# EAGLE design pov (EAGLE 6.1)
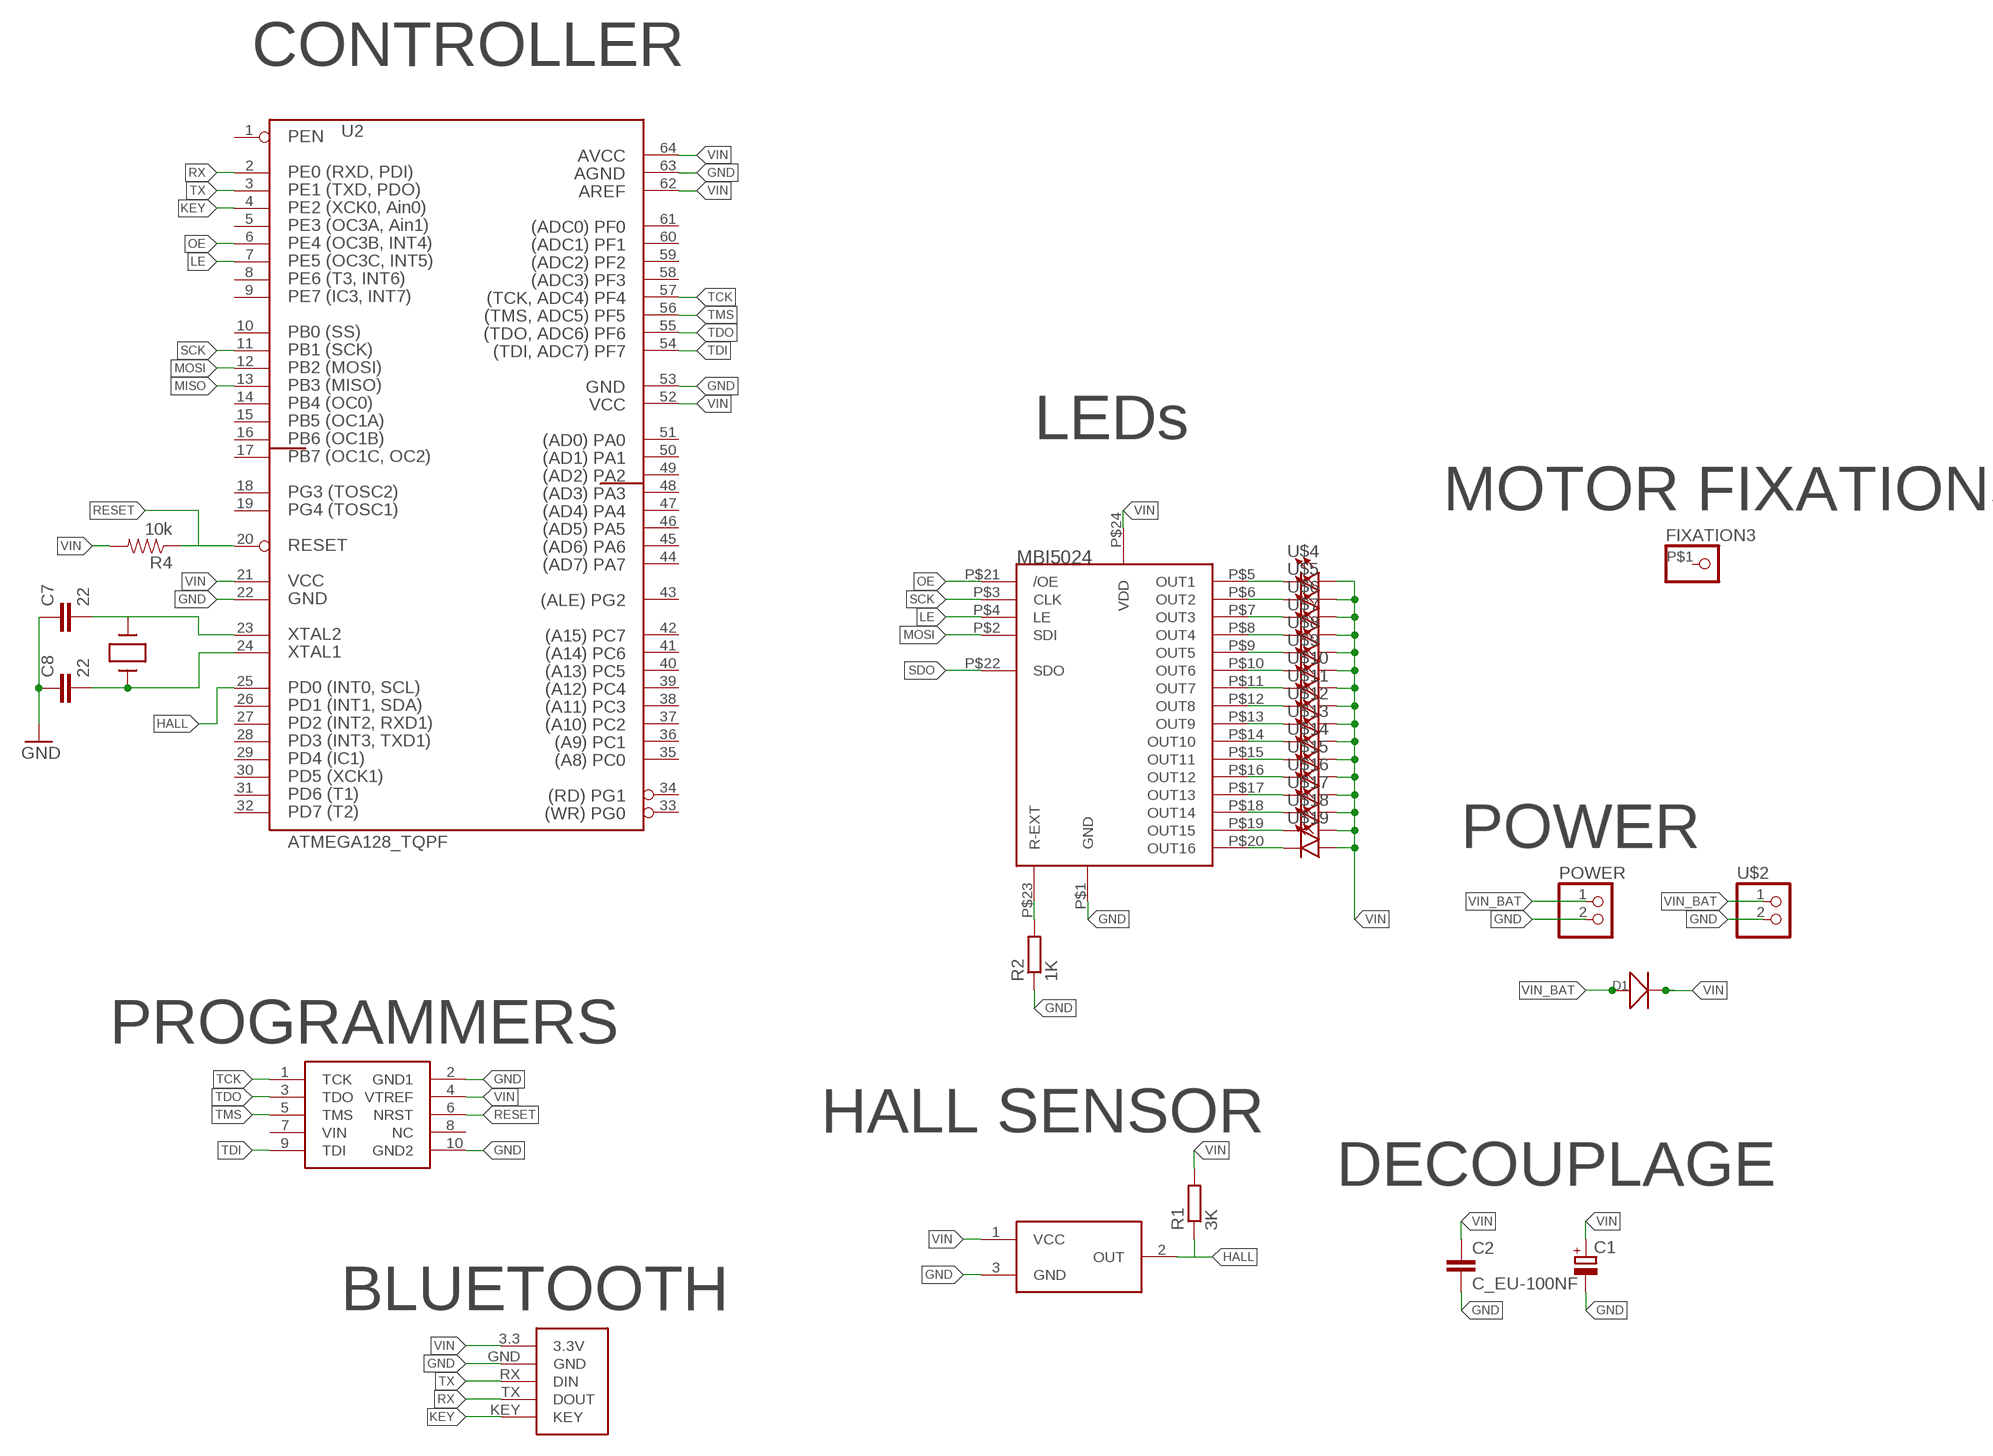
[diagram p0: schematic, sheet 1]

## Parts
C1  CPOL_EU-680UF_25V  [E3,5-8]
C2  C_EU-100NF  [C0805]
C7  22  C_EU_22PF  [C0603]
C8  22  C_EU_22PF  [C0603]
D1  D-SOD-123  [SOD123]
FIXATION3  CONNEC_1X01SHAFT  [SHAFT2]
JTAG  AVR_JTAG  [AVR_JTAG]
POWER  CONNEC_1X02BASIC  [CONNEC_1X02]
R1  3K  RESISTANCE-R0805  [R0805]
R2  1K  RESISTANCE-R0805  [R0805]
R4  10k  RESISTOR0805-RES  [0805]
U1  MBI5024  [SOP24L-300-1.0]
U2  ATMEGA128_TQPF  [TQFP64]
U$1  DRV5023FAEDBZRQ1  [SOT-23]
U$2  CONNEC_1X02  [JST_GH_2P]
U$4  LED1206  [LED-1206]
U$5  LED1206  [LED-1206]
U$6  LED1206  [LED-1206]
U$7  LED1206  [LED-1206]
U$8  LED1206  [LED-1206]
U$9  LED1206  [LED-1206]
U$10  LED1206  [LED-1206]
U$11  LED1206  [LED-1206]
U$12  LED1206  [LED-1206]
U$13  LED1206  [LED-1206]
U$14  LED1206  [LED-1206]
U$15  LED1206  [LED-1206]
U$16  LED1206  [LED-1206]
U$17  LED1206  [LED-1206]
U$18  LED1206  [LED-1206]
U$19  LED1206  [LED-1206]
U$23  HC05  [HC-05]
XTAL1  QUARTZ  [HC49US]

## Nets
GND: C1.- C2.2 C7.1 C8.1 JTAG.2(GND1) JTAG.10(GND2) POWER.2 R2.1 U1.P$1(GND) U2.22 U2.53 U2.63 U$1.3(GND) U$2.2 U$23.GND
HALL: R1.1 U2.25 U$1.2(OUT)
KEY: U2.4 U$23.KEY
LE: U1.P$4(LE) U2.7
MISO: U2.13
MOSI: U1.P$2(SDI) U2.12
N$1: U1.P$5(OUT1) U$4.C
N$2: U1.P$6(OUT2) U$5.C
N$3: U1.P$7(OUT3) U$6.C
N$4: U1.P$8(OUT4) U$7.C
N$5: U1.P$9(OUT5) U$8.C
N$6: U1.P$10(OUT6) U$9.C
N$7: U1.P$11(OUT7) U$10.C
N$8: U1.P$12(OUT8) U$11.C
N$9: U1.P$13(OUT9) U$12.C
N$10: U1.P$14(OUT10) U$13.C
N$11: U1.P$15(OUT11) U$14.C
N$12: U1.P$16(OUT12) U$15.C
N$13: U1.P$17(OUT13) U$16.C
N$14: U1.P$18(OUT14) U$17.C
N$15: U1.P$19(OUT15) U$18.C
N$16: U1.P$20(OUT16) U$19.C
N$18: R2.2 U1.P$23(R-EXT)
N$19: C7.2 U2.23 XTAL1.2
N$20: C8.2 U2.24 XTAL1.1
OE: U1.P$21(/OE) U2.6
RESET: JTAG.6(NRST) R4.1 U2.20
RX: U2.2 U$23.TX(DOUT)
SCK: U1.P$3(CLK) U2.11
SDO: U1.P$22(SDO)
TCK: JTAG.1(TCK) U2.57
TDI: JTAG.9(TDI) U2.54
TDO: JTAG.3(TDO) U2.55
TMS: JTAG.5(TMS) U2.56
TX: U2.3 U$23.RX(DIN)
VIN: C1.+ C2.1 D1.- JTAG.4(VTREF) R1.2 R4.2 U1.P$24(VDD) U2.21 U2.52 U2.62 U2.64 U$1.1(VCC) U$4.A U$5.A U$6.A U$7.A U$8.A U$9.A U$10.A U$11.A U$12.A U$13.A U$14.A U$15.A U$16.A U$17.A U$18.A U$19.A U$23.3.3(3.3V)
VIN_BAT: D1.+ POWER.1 U$2.1
Unconnected: FIXATION3.P$1 JTAG.7(VIN) JTAG.8(NC) U2.1 U2.5 U2.8 U2.9 U2.10 U2.14 U2.15 U2.16 U2.17 U2.18 U2.19 U2.26 U2.27 U2.28 U2.29 U2.30 U2.31 U2.32 U2.33 U2.34 U2.35 U2.36 U2.37 U2.38 U2.39 U2.40 U2.41 U2.42 U2.43 U2.44 U2.45 U2.46 U2.47 U2.48 U2.49 U2.50 U2.51 U2.58 U2.59 U2.60 U2.61

## Notes on the sheet
- CONTROLLER
- LEDs
- MOTOR FIXATIONS
- MBI5024
- POWER
- PROGRAMMERS
- HALL SENSOR
- DECOUPLAGE
- BLUETOOTH

## Library data of the parts
C1 = rhoban:CPOL_EU: 47uF: http://fr.farnell.com/panasonic-electronic-components/eee1ca470sp/condensateur-elec-alu-47uf-16v/dp/9696946 220uF: http://fr.farnell.com/panasonic-electronic-components/eeefk1c221xp/condensateur-elec-alu-220uf-16v/dp/1850103; DATASHEET: panasonic_aec.pdf; FARNELL_LINK: http://fr.farnell.com/panasonic/eeufr1e681l/capacitor-radial-25v-680uf-20/dp/2063069
C2 = rhoban:C_EU: non polarised condo; DATASHEET: condo100nF.pdf; FARNELL_LINK: http://fr.farnell.com/kemet/c0805c104j5ractu/condensateur-100nf-50v-x7r-0805/dp/1414663RL
C7 C8 = rhoban:C_EU: non polarised condo
D1 = OPL Eagle Library:D*: DIODE
FIXATION3 = rhoban:CONNEC_1X01
JTAG = rhoban:AVR_JTAG
POWER U$2 = rhoban:CONNEC_1X02
R1 R2 = rhoban:RESISTANCE: RESISTOR, European symbol
R4 = SparkFun-Passives:RESISTOR: Resistor Basic schematic elements and footprints for 0603, 1206, and PTH resistors.
U1 = rhoban:MBI5024
U2 = atmel_prototype_header:ATMEGA128: MICROCONTROLLER 128 Kbytes FLASH 4 Kbytes SRAM 4 Kbytes EEPROM DUAL USART 8-channel 10 bit ADC
U$1 = rhoban:DRV5023FAEDBZRQ1
U$4-U$19 = SparkFun-LED:LED: LED (Generic) Standard schematic elements and footprints for 5mm, 3mm, 1206, and 0603 sized LEDs. Generic LEDs with no color specified.
U$23 = rhoban:HC05
XTAL1 = rhoban:QUARTZ

## Net classes
1 alime: width 0.889 mm, drill 0.33 mm

## Board
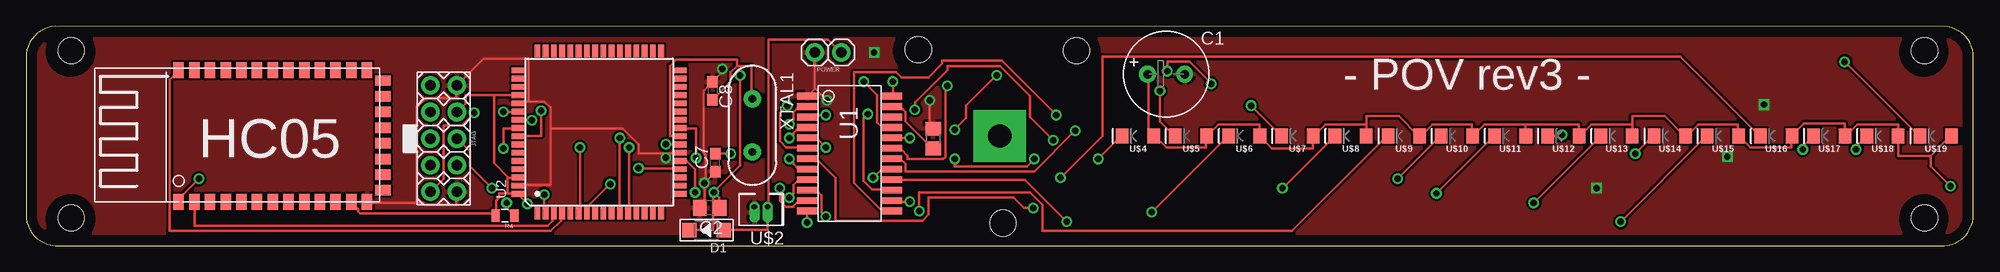
[diagram p1: board, top side]
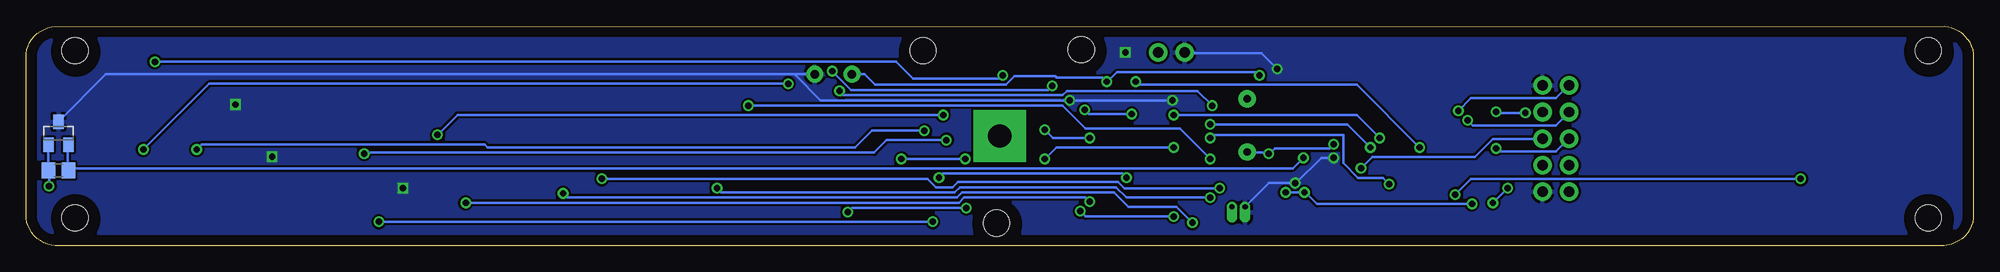
[diagram p2: board, bottom side, seen from below]

Size 185.97 x 21.01 mm. Coordinates in mm from the lower left corner, seen from the top.
Outline: 183.19,0 183.55,0.05 183.92,0.14 184.28,0.29 184.6,0.46 184.9,0.68 185.18,0.94 185.42,1.23 185.78,1.9 185.9,2.26 185.97,2.63 185.97,18.38 185.9,18.75 185.78,19.11 185.62,19.46 185.42,19.77 185.17,20.07 184.9,20.32 184.6,20.55 183.92,20.87 183.55,20.96 2.8,21.01 2.41,20.96 2.05,20.86 1.7,20.73 1.37,20.54 1.07,20.32 0.56,19.78 0.55,19.77 0.35,19.45 0.19,19.11 0.07,18.75 0,18.38 0,2.63 0.07,2.24 0.19,1.9 0.35,1.55 0.55,1.23 0.79,0.94 1.07,0.68 1.37,0.46 2.06,0.14 2.8,0 183.19,0
Copper layers (1*16): Top 0.035mm / dielectric 1.5mm / Bottom 0.035mm
Design rules: minimum track width 10mil, minimum drill 24mil, track to track 8mil, track to pad 8mil, pad to pad 8mil, via to via 8mil, smd to smd 8mil, copper to edge 40mil, drill to drill 8mil, minimum pad ring 10mil, minimum via ring 8mil, stop-mask expansion 4mil, vias tented up to drill 0mil, thermal gap 10mil
Holes 2.5 mm at 100.31,18.66 85.21,18.76 181.31,18.66 181.31,2.66 4.31,18.66 4.31,2.66 93.31,2.16
tRestrict: area 97.9,16.2 to 102.6,20.9; area 82.8,16.3 to 87.5,21; area 178.9,16.2 to 183.6,20.9; area 178.9,0.2 to 183.6,4.9; area 1.9,16.2 to 6.6,20.9; area 1.9,0.2 to 6.6,4.9; area 90.9,-0.3 to 95.6,4.4
bRestrict: area 97.9,16.2 to 102.6,20.9; area 82.8,16.3 to 87.5,21; area 178.9,16.2 to 183.6,20.9; area 178.9,0.2 to 183.6,4.9; area 1.9,16.2 to 6.6,20.9; area 1.9,0.2 to 6.6,4.9; area 90.9,-0.3 to 95.6,4.4

### Footprints (pad centres in the part's own frame; a part is rotated, then mirrored left to right if it is on the bottom)
E3,5-8 = drill 0.813 pad 1.6: + -1.778,0; - 1.778,0
C0805 = smd 1.3 x 1.5: 1 -0.95,0; 2 0.95,0
C0603 = smd 1.1 x 1: 1 -0.85,0; 2 0.85,0
SOD123 = smd 1.397 x 1.397: + -1.651,0; - 1.651,0
SHAFT2 = drill 2.2 pad 5 square: P$1 0,0
AVR_JTAG = drill 1 pad 1.778: 1 -5.08,-1.27; 2 -5.08,1.27; 3 -2.54,-1.27; 4 -2.54,1.27; 5 0,-1.27; 6 0,1.27; 7 2.54,-1.27; 8 2.54,1.27; 9 5.08,-1.27; 10 5.08,1.27
CONNEC_1X02 = drill 1 pad 1.778: 1 -1.27,1.27; 2 1.27,1.27
R0805 = smd 1.3 x 1.5: 1 -0.95,0; 2 0.95,0
0805 = smd 0.8 x 1.2: 1 -0.9,0; 2 0.9,0
SOP24L-300-1.0 = smd 0.65 x 2: P$1 1,-1; P$2 2,-1; P$3 3,-1; P$4 4,-1; P$5 5,-1; P$6 6,-1; P$7 7,-1; P$8 8,-1; P$9 9,-1; P$10 10,-1; P$11 11,-1; P$12 12,-1; P$13 12,7; P$14 11,7; P$15 10,7; P$16 9,7; P$17 8,7; P$18 7,7; P$19 6,7; P$20 5,7; P$21 4,7; P$22 3,7; P$23 2,7; P$24 1,7
TQFP64 = smd 1.194 x 0.559: 1 -7.76,5.905; 2 -7.76,5.118; 3 -7.76,4.331; 4 -7.76,3.543; 5 -7.76,2.756; 6 -7.76,1.968; 7 -7.76,1.181; 8 -7.76,0.394; 9 -7.76,-0.394; 10 -7.76,-1.181; 11 -7.76,-1.968; 12 -7.76,-2.756; 13 -7.76,-3.543; 14 -7.76,-4.331; 15 -7.76,-5.118; 16 -7.76,-5.905; 33 7.76,-5.905; 34 7.76,-5.118; 35 7.76,-4.331; 36 7.76,-3.543; 37 7.76,-2.756; 38 7.76,-1.968; 39 7.76,-1.181; 40 7.76,-0.394; 41 7.76,0.394; 42 7.76,1.181; 43 7.76,1.968; 44 7.76,2.756; 45 7.76,3.543; 46 7.76,4.331; 47 7.76,5.118; 48 7.76,5.905 | smd 0.559 x 1.194: 17 -5.905,-7.76; 18 -5.118,-7.76; 19 -4.331,-7.76; 20 -3.543,-7.76; 21 -2.756,-7.76; 22 -1.968,-7.76; 23 -1.181,-7.76; 24 -0.394,-7.76; 25 0.394,-7.76; 26 1.181,-7.76; 27 1.968,-7.76; 28 2.756,-7.76; 29 3.543,-7.76; 30 4.331,-7.76; 31 5.118,-7.76; 32 5.905,-7.76; 49 5.905,7.76; 50 5.118,7.76; 51 4.331,7.76; 52 3.543,7.76; 53 2.756,7.76; 54 1.968,7.76; 55 1.181,7.76; 56 0.394,7.76; 57 -0.394,7.76; 58 -1.181,7.76; 59 -1.968,7.76; 60 -2.756,7.76; 61 -3.543,7.76; 62 -4.331,7.76; 63 -5.118,7.76; 64 -5.905,7.76
SOT-23 = smd 1 x 1.4: 1 -0.95,-1.1; 2 0.95,-1.1; 3 0,1.1
JST_GH_2P = drill 0.5 pad 1 offset: 1 -0.685,-0.495; 2 0.565,-0.495
LED-1206 = smd 1.2 x 1.4: A -1.5,0; C 1.5,0
HC-05 = smd 1.5 x 1: 3.3 0,-16.5; GND 0,-18; KEY 12.6,0; P$3 0,-3; P$4 0,-4.5; P$5 0,-6; P$6 0,-7.5; P$7 0,-9; P$8 0,-10.5; P$9 0,-12; P$10 0,-13.5; P$11 0,-15; P$23 12.6,-1.5; P$24 12.6,-3; P$25 12.6,-4.5; P$26 12.6,-6; P$27 12.6,-7.5; P$28 12.6,-9; P$29 12.6,-10.5; P$30 12.6,-12; P$31 12.6,-13.5; P$32 12.6,-15; P$33 12.6,-16.5; P$34 12.6,-18; RX 0,-1.5; TX 0,0 | smd 1 x 1.5: P$14 1.1,-19.5; P$15 2.6,-19.5; P$16 4.1,-19.5; P$17 5.6,-19.5; P$18 7.1,-19.5; P$19 8.6,-19.5; P$20 10.1,-19.5; P$21 11.6,-19.5
HC49US = drill 0.7 pad 1.651: 1 -2.54,0; 2 2.54,0

### Placement (x,y rotation side)
C1  108.87,16.42 0 top
C2  65.29,3.63 180 top
C7  65.8,7.95 90 top
C8  65.54,14.81 270 top
D1  64.99,1.5 180 top
FIXATION3  92.99,10.5 0 top
JTAG  39.87,10.25 270 top
POWER  76.6,19.75 180 top
R1  182.89,7.2 180 bottom
R2  86.64,10.25 270 top
R4  45.73,2.88 180 top
U1  75.65,15.32 270 top
U2  54.73,10.87 90 top
U$1  182.89,10.76 0 bottom
U$2  70.12,3.22 180 top
U$4  106.18,10.5 180 top
U$5  111.26,10.5 180 top
U$6  116.34,10.5 180 top
U$7  121.42,10.5 180 top
U$8  126.5,10.5 180 top
U$9  131.58,10.5 180 top
U$10  136.66,10.5 180 top
U$11  141.74,10.5 180 top
U$12  146.82,10.5 180 top
U$13  151.9,10.5 180 top
U$14  156.98,10.5 180 top
U$15  162.06,10.5 180 top
U$16  167.14,10.5 180 top
U$17  172.22,10.5 180 top
U$18  177.3,10.5 180 top
U$19  182.38,10.5 180 top
U$23  14.56,4.2 90 top
XTAL1  69.35,11.5 270 top

### Tracks (layer width: path | path; a pad name or v marks a point on that pad's centre or on a via)
GND  (via drill 0.6, 0.61)
  Top 0.254: 64.94,6.15 v64.79,6 64.79,4.1 64.39,3.7 C2.2 | 64.94,6.15 65.79,7 C7.1 | 64.94,6.15 64.89,6.2 64.89,8.7 64.69,8.9 64.69,14.8 65.49,15.6 C8.1 65.59,15.7 66.49,16.6 v66.49,16.9 | 37.29,4.1 37.89,4.1 38.09,3.9 41.09,3.9 41.09,5.1 JTAG.10 | 37.29,4.1 32.59,4.1 U$23.GND | 50.09,11.2 50.09,13.2 49.49,13.8 47.99,13.8 | 50.09,11.2 50.09,5.8 46.99,5.8 U2.63 | 47.99,13.8 47.79,13.8 47.69,13.7 46.99,13.7 U2.53 | 61.09,8.8 58.49,8.8 58.49,9.7 56.99,11.2 50.09,11.2 | 61.09,8.8 62.49,8.8 U2.22 | 47.99,13.8 47.99,17.9 43.69,17.9 41.19,15.4 JTAG.2 41.09,15.3 41.09,14.1 38.19,14.1 37.29,13.2 37.29,4.1 | 61.09,8.8 v61.09,8.4 | 75.29,15 74.69,14.4 U1.P$1 | 75.29,15 75.29,18.4 POWER.2 | v86.29,13.9 86.29,11.5 86.59,11.2 R2.1 | v76.49,13.9 75.39,15 75.29,15
  Bottom 0.254: U$2.2 69.49,3.8 67.29,6 v64.79,6 64.69,6 62.29,8.4 v61.09,8.4 | 112.49,16.4 110.69,16.4 C1.- | 112.49,16.4 178.39,16.4 182.89,11.9 U$1.3 | 112.49,16.4 112.49,16.3 110.09,13.9 v86.29,13.9 v76.49,13.9 | v66.49,16.9 67.99,18.4 75.29,18.4 POWER.2
  other vias: 165.99,13.5 162.49,8.5 149.99,5.5 80.99,18.5
  pour Bottom: 5.49,31 194.99,31 194.99,-14.5 -8.01,-14.5 -8.01,9
  pour Top: -0.01,32.5 199.99,32.5 199.99,-16.5 -27.51,-16.5 -27.51,17
HALL  (via drill 0.61)
  Top 0.254: v63.99,8.4 63.99,11.2 62.59,11.2 U2.25
  Bottom 0.254: v63.99,8.4 64.99,7.4 181.69,7.4 181.89,7.2 R1.1 181.99,7.3 181.99,9.6 U$1.2
KEY
  Top 0.254: U2.4 51.09,3 51.09,2.4 50.09,1.4 13.69,1.4 13.69,15.9 14.49,16.7 U$23.KEY
LE  (via drill 0.61)
  Top 0.254: v55.79,5.9 53.69,3.8 53.69,3.3 53.59,3.2 U2.7 | v72.89,10.3 73.29,10.7 73.29,10.8 73.79,11.3 74.59,11.3 U1.P$4
  Bottom 0.254: v55.79,5.9 56.39,6.5 58.79,6.5 60.19,7.9 60.19,10.6 72.59,10.6 v72.89,10.3
MOSI  (via drill 0.61)
  Top 0.254: v57.59,9.4 57.59,3.2 U2.12 | v72.89,11.6 73.29,12 73.29,12.8 73.79,13.3 74.59,13.3 U1.P$2
  Bottom 0.254: v57.59,9.4 59.79,11.6 v72.89,11.6
N$1  (via drill 0.61)
  Top 0.254: v102.39,8.3 104.59,10.5 U$4.C | v96.29,8.3 95.59,7.6 88.69,7.6 v88.69,8.3 | v76.39,9.4 75.49,10.3 74.69,10.3 U1.P$5
  Bottom 0.254: v96.29,8.3 v102.39,8.3 | v88.69,8.3 87.59,9.4 v76.39,9.4
N$2  (via drill 0.61)
  Top 0.254: v108.29,14.8 108.29,11.9 109.69,10.5 U$5.C | v72.69,13.4 71.99,12.7 71.99,10 72.59,9.4 74.59,9.4 U1.P$6
  Bottom 0.254: v108.29,14.8 107.89,14.4 86.99,14.4 86.59,14.8 74.09,14.8 v72.69,13.4
N$3  (via drill 0.61)
  Top 0.254: v107.49,3.2 114.79,10.5 U$6.C | v96.19,3.6 95.29,3.6 94.29,4.6 86.19,4.6 86.19,3 85.59,2.4 77.29,2.4 77.29,6.5 75.49,8.3 74.69,8.3 U1.P$7
  Bottom 0.254: v107.49,3.2 107.09,3.6 v96.19,3.6
N$4  (via drill 0.61)
  Top 0.254: v116.99,13.4 119.89,10.5 U$7.C | v72.89,8.3 73.29,7.9 73.29,7.8 73.69,7.4 74.59,7.4 U1.P$8
  Bottom 0.254: v116.99,13.4 86.99,13.4 84.79,11.2 75.79,11.2 v72.89,8.3
N$5  (via drill 0.61)
  Top 0.254: v119.99,5.5 U$8.C | v72.89,4.6 73.29,5 73.29,5.8 73.79,6.3 74.59,6.3 U1.P$9
  Bottom 0.254: v119.99,5.5 119.59,5.1 97.29,5.1 96.79,5.6 81.89,5.6 80.89,4.6 v72.89,4.6
N$6  (via drill 0.61)
  Top 0.254: v85.29,3.3 85.29,5.1 95.89,5.1 97.09,3.9 97.09,1.4 120.89,1.4 129.99,10.5 U$9.C | v76.39,2.8 75.99,3.2 75.99,4.8 75.49,5.3 74.69,5.3 U1.P$10
  Bottom 0.254: v85.29,3.3 84.79,2.8 v76.39,2.8
N$7  (via drill 0.61)
  Top 0.254: v130.99,6.4 135.09,10.5 U$10.C | v71.99,5.5 71.99,4.3 72.59,3.7 73.29,3.7 73.29,3.8 73.79,4.3 74.59,4.3 U1.P$11
  Bottom 0.254: v130.99,6.4 99.89,6.4 99.09,5.6 97.49,5.6 96.99,6.1 81.69,6.1 81.09,5.5 v71.99,5.5
N$8  (via drill 0.61)
  Top 0.254: v134.69,5 140.19,10.5 U$11.C | v74.59,2.2 74.59,3.3 U1.P$12
  Bottom 0.254: v134.69,5 134.29,4.6 97.09,4.6 96.59,5.1 82.09,5.1 80.69,3.7 76.09,3.7 v74.59,2.2
N$9  (via drill 0.61)
  Top 0.254: U$12.C 146.69,10.5 v146.69,10.6 | v98.39,12.5 93.19,17.7 87.49,17.7 87.49,17.4 86.19,16.1 83.59,16.1 83.09,16.6 79.09,16.6 79.09,6 81.69,3.4 82.59,3.4 U1.P$13
  Bottom 0.254: v146.69,10.6 144.79,12.5 v98.39,12.5
N$10  (via drill 0.61)
  Top 0.254: v143.99,4.1 U$13.C | v84.39,4.2 82.69,4.2 82.69,4.3 U1.P$14
  Bottom 0.254: v143.99,4.1 96.89,4.1 96.39,4.6 84.79,4.6 v84.39,4.2
N$11  (via drill 0.61)
  Top 0.254: v153.69,8.8 155.39,10.5 U$14.C | v98.09,10.1 95.89,12.3 95.89,14.3 92.99,17.2 87.99,17.2 87.99,16.8 84.89,13.7 v84.89,13 | v80.39,12.6 79.99,12.2 79.99,6.2 80.79,5.4 82.59,5.4 U1.P$15
  Bottom 0.254: v153.69,8.8 153.59,8.9 104.99,8.9 103.79,10.1 v98.09,10.1 | v84.89,13 84.49,12.6 v80.39,12.6
N$12  (via drill 0.61)
  Top 0.254: v152.29,2.3 160.49,10.5 U$15.C | v99.39,2.3 95.39,6.3 82.69,6.3 U1.P$16
  Bottom 0.254: v99.39,2.3 v152.29,2.3
N$13  (via drill 0.61)
  Top 0.254: v98.79,6.5 102.79,10.5 102.79,18.1 157.99,18.1 165.59,10.5 U$16.C | v80.89,6.5 81.69,7.3 82.59,7.3 U1.P$17
  Bottom 0.254: v98.79,6.5 98.39,6.9 81.29,6.9 v80.89,6.5
N$14  (via drill 0.61)
  Top 0.254: v169.69,9.2 169.69,9.5 170.69,10.5 U$17.C | v100.19,11 96.29,7.1 83.99,7.1 83.99,7.8 83.49,8.3 82.69,8.3 U1.P$18
  Bottom 0.254: v169.69,9.2 169.19,9.7 142.19,9.7 141.89,9.4 106.79,9.4 105.19,11 v100.19,11
N$15  (via drill 0.61)
  Top 0.254: v174.79,9.2 174.79,9.5 U$18.C | v113.19,15.5 111.09,17.6 108.99,17.6 v108.99,16.7 | v87.99,15.3 87.79,15.1 87.79,8.5 87.59,8.3 84.19,8.3 84.19,8.6 83.49,9.3 82.69,9.3 U1.P$19
  Bottom 0.254: v174.79,9.2 168.49,15.5 v113.19,15.5 | v108.99,16.7 107.19,14.9 88.39,14.9 v87.99,15.3
N$16  (via drill 0.61)
  Top 0.254: v173.69,17.6 180.79,10.5 U$19.C | v92.69,16.3 89.79,13.4 89.79,12.2 v88.69,11.1 | v84.39,10.3 82.69,10.3 U1.P$20
  Bottom 0.254: v173.69,17.6 102.89,17.6 101.29,16 92.99,16 v92.69,16.3 | v88.69,11.1 87.89,10.3 v84.39,10.3
N$18
  Top 0.254: R2.2 86.59,9.3 83.99,11.9 83.99,12.8 83.49,13.3 82.69,13.3 U1.P$23
N$19  (via drill 0.61)
  Top 0.254: v67.29,8.8 65.89,8.8 C7.2 | v61.09,9.7 62.49,9.7 U2.23
  Bottom 0.254: XTAL1.2 69.29,8.9 67.39,8.9 v67.29,8.8 67.19,8.8 66.69,9.3 61.49,9.3 v61.09,9.7
N$20
  Top 0.254: 67.89,17.2 67.29,16.6 67.29,15.7 65.59,14 C8.2 | 67.89,17.2 69.29,17.2 69.29,14.1 XTAL1.1 | 67.89,17.2 67.89,17.8 62.09,17.8 61.49,17.2 61.49,10.5 62.49,10.5 U2.24
OE  (via drill 0.61)
  Top 0.254: v52.89,9.4 52.89,3.3 52.79,3.2 U2.6 | v79.99,15.7 81.29,14.4 81.29,11.8 81.69,11.4 82.59,11.4 U1.P$21
  Bottom 0.254: v52.89,9.4 58.89,15.4 79.69,15.4 v79.99,15.7
RESET  (via drill 0.61)
  Top 0.254: v58.49,7.4 62.49,7.4 U2.20 | v45.89,4.1 45.89,3.6 46.59,2.9 R4.1 | v44.49,5.5 42.39,7.6 42.39,9 41.19,10.2 JTAG.6
  Bottom 0.254: v58.49,7.4 57.39,8.5 47.59,8.5 45.89,10.2 41.19,10.2 JTAG.6 | v44.49,5.5 v45.89,4.1
RX  (via drill 0.61)
  Top 0.254: v49.49,4.9 49.49,3.3 49.59,3.2 U2.2 | v16.49,6.4 14.59,4.5 14.59,4.2 U$23.TX
  Bottom 0.254: v49.49,4.9 47.99,6.4 v16.49,6.4
SCK  (via drill 0.61)
  Top 0.254: v56.69,10.3 56.69,3.2 U2.11 | v76.39,12.5 74.69,12.5 74.69,12.4 U1.P$3
  Bottom 0.254: v56.69,10.3 58.89,12.5 v76.39,12.5
TCK  (via drill 0.61)
  Top 0.254: v49.19,12.9 49.19,10.5 46.99,10.5 U2.57
  Bottom 0.254: v49.19,12.9 47.99,14.1 39.89,14.1 38.69,15.3 JTAG.1
TDI  (via drill 0.61)
  Top 0.254: v45.59,12.8 46.89,12.8 U2.54 | v42.79,12.7 41.59,11.5 39.89,11.5 39.89,6.4 38.69,5.2 JTAG.9
  Bottom 0.254: v45.59,12.8 45.49,12.7 v42.79,12.7
TDO  (via drill 0.61)
  Top 0.254: v48.29,12 46.99,12 U2.55
  Bottom 0.254: v48.29,12 47.79,11.5 39.89,11.5 38.69,12.7 JTAG.3
TMS  (via drill 0.61)
  Top 0.254: v45.59,9.3 45.59,11.2 46.89,11.2 U2.56
  Bottom 0.254: v45.59,9.3 45.29,9 39.89,9 38.69,10.2 JTAG.5
TX
  Top 0.254: U2.3 50.39,3.1 50.29,3 50.29,2.4 49.79,1.9 16.09,1.9 16.09,4.1 U$23.RX
VIN  (via drill 0.61)
  Top 0.254: 44.69,14.4 41.99,14.4 41.99,13.6 41.19,12.8 JTAG.4 | 44.69,14.4 46.89,14.4 U2.52 | v63.89,5.1 63.89,7.3 63.09,8.1 62.59,8.1 U2.21 | v65.69,5.1 66.19,4.6 66.19,3.7 C2.1 | D1.- 65.59,1.5 65.59,5.1 v65.69,5.1 | 45.99,5 45.19,5 45.19,4.6 44.89,4.3 44.89,2.9 R4.2 44.79,3.1 31.89,3.1 31.69,3.3 31.69,3.5 31.09,4.1 U$23.3.3 | 45.99,5 46.89,5 U2.64 46.99,4.9 v47.89,4 | 45.99,6.5 46.89,6.5 U2.62 | 45.99,5 45.99,6.5 | 44.69,14.4 44.69,7.9 45.99,6.6 45.99,6.5 | C1.+ 107.19,16.4 107.19,10.9 107.59,10.5 U$4.A 107.79,10.5 108.89,9.4 112.69,9.4 112.69,10.4 U$5.A 112.79,10.5 113.89,11.6 117.79,11.6 117.79,10.5 U$6.A 117.89,10.4 118.99,9.3 122.89,9.3 122.89,10.4 U$7.A 122.99,10.5 124.09,11.6 127.99,11.6 | v82.79,15.7 82.79,14.5 82.69,14.4 U1.P$24 | 127.99,11.6 U$8.A | 127.99,11.6 127.99,12.4 131.09,12.4 132.99,10.5 U$9.A 133.19,10.5 134.29,11.6 138.09,11.6 138.09,10.6 U$10.A 138.19,10.5 139.29,11.6 143.19,11.6 | 143.19,11.6 143.19,10.5 U$11.A | 153.39,11.6 149.49,11.6 148.39,10.5 U$12.A 148.29,10.6 148.29,11.6 143.19,11.6 | 153.39,11.6 U$13.A | 153.39,11.6 153.39,12.4 156.49,12.4 158.39,10.5 U$14.A 158.59,10.5 159.69,11.6 163.49,11.6 163.49,10.6 U$15.A 163.59,10.5 164.69,9.4 168.59,9.4 168.59,10.5 U$16.A 168.69,10.6 169.79,11.7 173.69,11.7 173.69,10.6 U$17.A 173.79,10.5 174.89,11.6 178.79,11.6 U$18.A 178.79,10.4 178.79,8.6 181.89,8.6 | 181.89,8.6 183.79,10.5 U$19.A | v183.79,5.7 181.89,7.6 181.89,8.6 | v68.19,16.3 68.19,7.7 65.69,5.2 v65.69,5.1
  Bottom 0.254: v65.69,5.1 v63.89,5.1 63.79,5.1 62.69,4 v47.89,4 | C1.+ 105.89,16.4 104.89,15.4 92.39,15.4 91.59,16.2 87.69,16.2 87.59,16.1 83.19,16.1 v82.79,15.7 82.69,15.7 81.79,16.6 68.49,16.6 v68.19,16.3 | U$1.1 183.89,9.6 183.89,7.2 R1.2 183.79,7.1 v183.79,5.7
VIN_BAT
  Top 0.254: D1.+ 70.79,1.5 70.79,3.7 U$2.1 70.89,3.8 70.89,19.7 76.59,19.7 77.79,18.5 POWER.1

### Text on the board
_tsilk: - POV rev3 -